# EAGLE design Airflow (EAGLE 7.2.0)
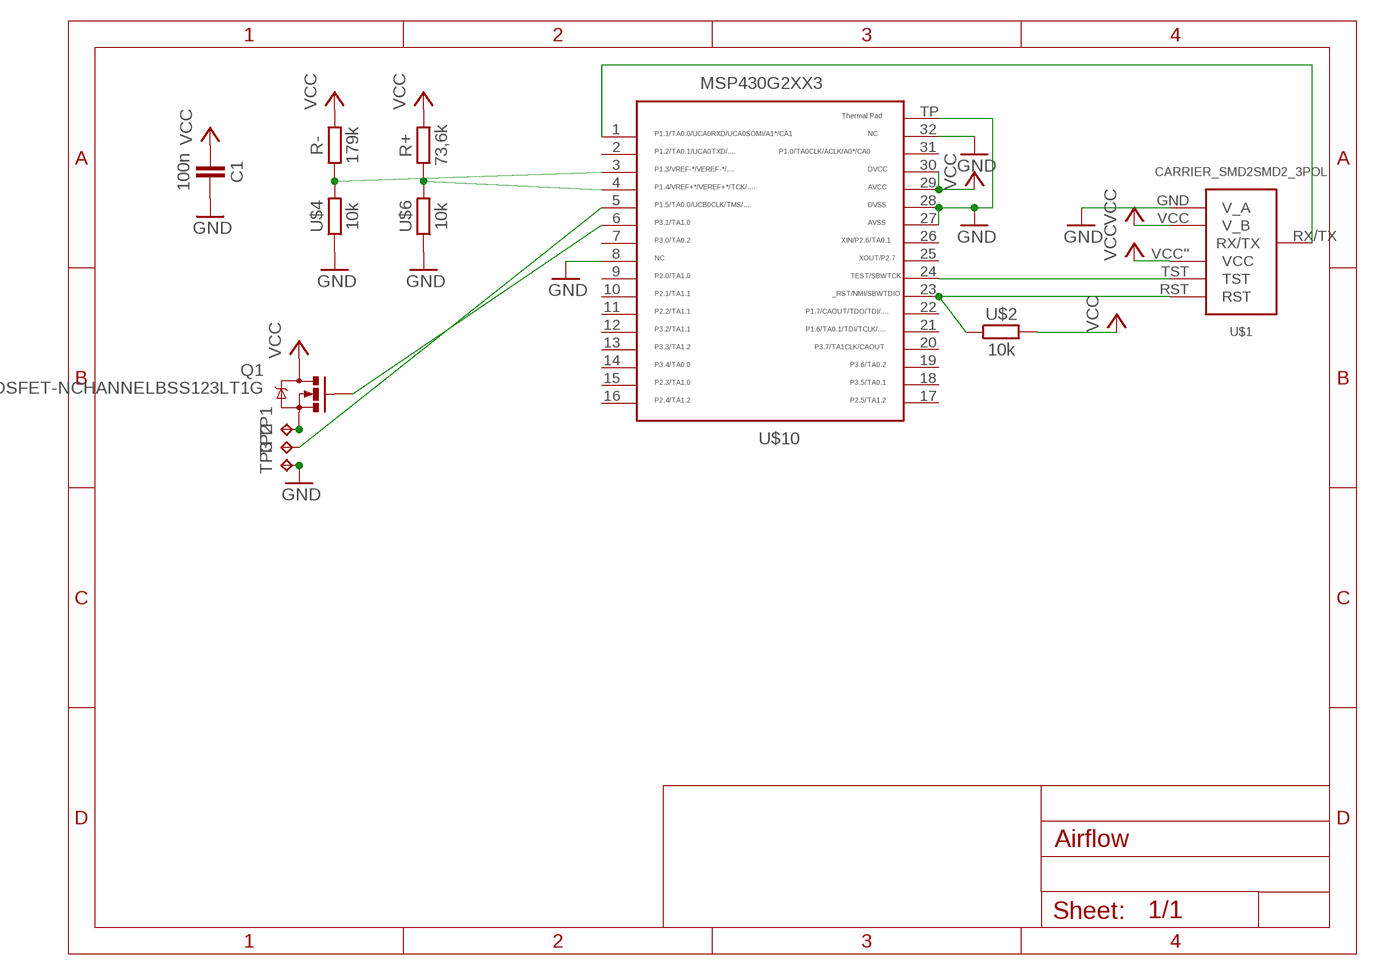
[diagram p0: schematic, sheet 1]

## Parts
C1  100n  CAPACITOR  [603]
Q1  MOSFET-NCHANNELBSS123LT1G  [SOT23-3]
R+  73,6k  RESISTOR0603  [603]
R-  179k  RESISTOR0603  [603]
TP1  TPTP18SQ  [TP18SQ]
TP2  TPTP18SQ  [TP18SQ]
TP3  TPTP18SQ  [TP18SQ]
U$1  CARRIER_SMD2SMD2_3POL  [CARRIER_SMD2_3POL]
U$2  10k  RESISTOR0603  [603]
U$4  10k  RESISTOR0603  [603]
U$6  10k  RESISTOR0603  [603]
U$10  MSP430G2553  [QFN32]

## Nets
GND: C1.2 TP3.TP U$1.GND(V_A) U$4.1 U$6.1 U$10.8 U$10.27 U$10.28 U$10.32 U$10.TP
N$2: R-.1 U$4.2 U$10.3
N$3: U$1.TST U$10.24
N$4: U$1.RST U$2.1 U$10.23
N$5: R+.1 U$6.2 U$10.4
N$6: TP2.TP U$10.5
N$7: Q1.2(S) TP1.TP
N$11: Q1.1(G) U$10.6
N$12: U$1.RX/TX U$10.1
VCC: C1.1 Q1.3(D) R+.2 R-.2 U$1.VCC''(VCC) U$1.VCC(V_B) U$2.2 U$10.29 U$10.30
Unconnected: U$10.2 U$10.7 U$10.9 U$10.10 U$10.11 U$10.12 U$10.13 U$10.14 U$10.15 U$10.16 U$10.17 U$10.18 U$10.19 U$10.20 U$10.21 U$10.22 U$10.25 U$10.26 U$10.31

## Library data of the parts
C1 = thar:CAPACITOR
Q1 = SparkFun-DiscreteSemi:MOSFET-NCHANNEL: Common NMOSFET Parts MFG P/N Store ID Prod ID FDD8780 TRANS-09984 SI7820DN TRANS-11055 FDS6630A IC-08089 2N7002PW TRANS-11151 FQP30N06L COM-10213 TRANS-10060 BSS123LT1G TRANS-08345 BSS138 TRANS-00830 BS170 2N7000; PROD_ID: TRANS-08345
R+ R- U$2 U$4 U$6 = thar:RESISTOR
TP1-TP3 = testpad:TP: Test pad
U$1 = thar:CARRIER_SMD2
U$10 = thar:MSP430G2553: TEXAS INSTRUMENTS MSP430G2553IRHB32R MCU, 16BIT, MSP430, 16MHZ, QFN-32 Farnell Best.Nr.: 2325726 Herst.Bez.: MSP430G2553IRHB32R

## Board
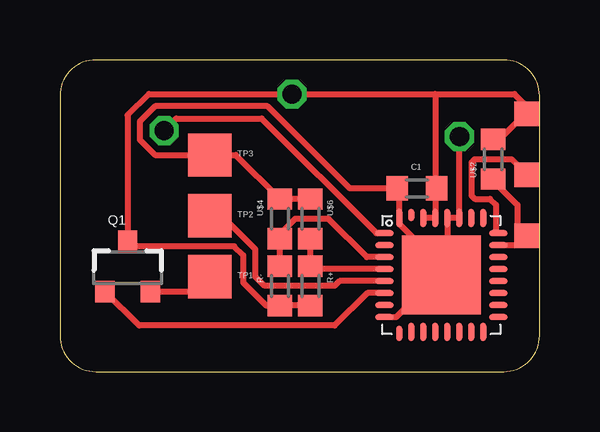
[diagram p1: board, top side]
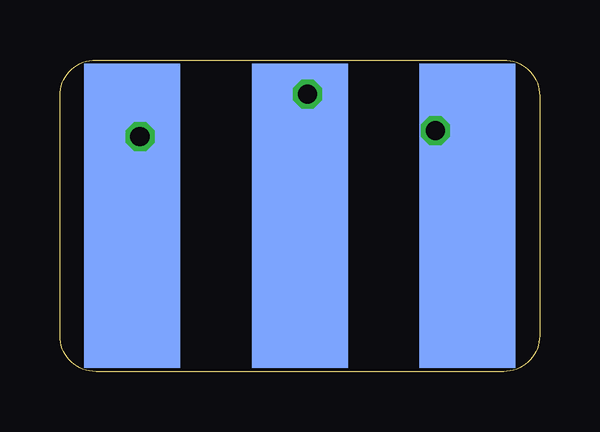
[diagram p2: board, bottom side, seen from below]

Size 20 x 13 mm. Coordinates in mm from the lower left corner, seen from the top.
Copper layers (1*16): Top 0.035mm / dielectric 1.5mm / Bottom 0.035mm
Design rules "Bilex DRU *": minimum track width 10mil, minimum drill 24mil, track to track 10mil, track to pad 10mil, pad to pad 10mil, via to via 10mil, smd to smd 10mil, copper to edge 1mil, drill to drill 8mil, minimum pad ring 10mil, minimum via ring 8mil, stop-mask expansion 4mil, vias tented up to drill 0mil, thermal gap 10mil

### Footprints (pad centres in the part's own frame; a part is rotated, then mirrored left to right if it is on the bottom)
603 = smd 0.889 x 1.016: 1 -0.826,0; 2 0.826,0
SOT23-3 = smd 0.8 x 0.9: 1 -0.95,-1; 2 0.95,-1; 3 0,1.1
TP18SQ = smd 1.8 x 1.8: TP 0,0
CARRIER_SMD2_3POL = smd 4 x 12.7 bottom: GND -6.985,0; RX/TX 6.985,0; VCC 0,0 | smd 1.016 x 1.016: RST -9.461,0.826; TST -9.461,-1.714; VCC'' -9.461,-4.255
QFN32 = smd 0.762 x 0.254: 1 -2.375,1.75; 2 -2.375,1.25; 3 -2.375,0.75; 4 -2.375,0.25; 5 -2.375,-0.25; 6 -2.375,-0.75; 7 -2.375,-1.25; 8 -2.375,-1.75; 17 2.375,-1.75; 18 2.375,-1.25; 19 2.375,-0.75; 20 2.375,-0.25; 21 2.375,0.25; 22 2.375,0.75; 23 2.375,1.25; 24 2.375,1.75 | smd 0.254 x 0.635: 9 -1.75,-2.438 | smd 0.254 x 0.762: 10 -1.25,-2.375; 11 -0.75,-2.375; 12 -0.25,-2.375; 13 0.25,-2.375; 14 0.75,-2.375; 15 1.25,-2.375; 16 1.75,-2.375; 25 1.75,2.375; 26 1.25,2.375; 27 0.75,2.375; 28 0.25,2.375; 29 -0.25,2.375; 30 -0.75,2.375; 32 -1.75,2.375 | smd 0.254 x 0.508: 31 -1.25,2.5 | smd 3.302 x 3.302: TP 0,0

### Placement (x,y rotation side)
C1  14.89,7.64 180 top
Q1  2.82,4.34 0 top
R+  10.44,3.58 270 top
R-  9.17,3.58 270 top
TP1  6.25,3.96 0 top
TP2  6.25,6.5 0 top
TP3  6.25,9.04 0 top
U$1  10,6.5 180 top
U$2  18.06,8.86 90 top
U$4  9.17,6.37 270 top
U$6  10.44,6.37 270 top
U$10  15.9,4.03 0 top

### Tracks (layer width: path | path; a pad name or v marks a point on that pad's centre or on a via)
GND  (via drill 0.8)
  Top 0.254: 16.43,4.35 16.19,5.38 16.16,5.35 | 16.43,4.35 16.48,3.06 U$10.TP 15.01,2.94 14.89,3.14 14.03,2.28 U$10.8 | 14.12,7.58 C1.2 | 16.15,4.72 U$10.28 U$10.27 16.65,9.79 v16.66,9.8 | 16.15,4.72 16.15,4.42 16.43,4.35 | 16.15,4.72 15.52,5.35 14.76,5.55 14.15,6.16 U$10.32 14.15,6.98 14.12,7.51 14.06,7.58 C1.2 | C1.2 14.06,7.7 | 14.06,7.7 14.12,7.77 14,7.77 14.06,7.7 | 14.06,7.7 14.12,7.64 12.09,7.64 8.66,11.07 3.96,11.07 3.33,10.43 3.33,9.67 3.96,9.04 TP3.TP 7.33,9.04 U$4.1 U$6.1
  Bottom 0.254: 18,6.5 17.81,6.69 v16.66,9.8 16.98,10.37 U$1.GND
N$2
  Top 0.254: R-.1 U$4.2 9.17,5.74 9.81,6.37 11.2,6.37 12.79,4.78 U$10.3
N$3
  Top 0.254: 19.61,7.88 19.46,8.02 19.5,8.18 U$1.TST | U$10.24 18.19,5.78 18.19,6.95 17.93,7.21 17.3,7.21 17.17,7.33 17.17,8.73 17.3,8.86 18.82,8.86 19.43,8.25 U$1.TST | U$1.TST
N$4
  Top 0.254: 19.46,5.48 19.5,5.38 | 19.46,5.48 19.5,5.69 | 19.5,5.69 19.08,5.74 19.08,6.95 18.06,7.97 U$2.1 | U$10.23 19.28,5.28 19.46,5.48 | 19.5,5.69 19.48,5.69 U$1.RST
N$5
  Top 0.254: U$6.2 R+.1 10.56,4.28 U$10.4
N$6
  Top 0.254: U$10.5 11.66,3.78 11.46,3.58 8.54,3.58 8.16,3.96 8.16,5.1 6.76,6.5 TP2.TP
N$7
  Top 0.254: Q1.2 5.63,3.34 TP1.TP
N$11
  Top 0.254: U$10.6 12.81,3.28 11.46,1.92 3.31,1.92 Q1.1
N$12  (via drill 0.8)
  Top 0.254: 13.32,5.78 U$10.1 13.19,5.78 8.41,10.56 4.85,10.56 v4.35,10.05
  Bottom 0.254: U$1.RX/TX 3.4,9.74 v4.35,10.05
VCC  (via drill 0.8)
  Top 0.254: U$10.29 | 15.65,11.58 15.65,8.02 | 15.65,8.02 U$10.29 | 15.65,7.77 15.59,8.02 | 15.59,8.02 15.65,8.02 | U$10.29 U$10.30 | C1.1 15.59,8.02 | 19.5,10.52 19.46,10.56 | U$2.2 18.12,9.48 19.2,10.56 19.2,10.51 19.46,10.56 | 19.46,10.56 19.65,10.75 19.65,10.95 19.58,10.95 18.95,11.58 15.65,11.58 | 19.46,10.56 U$1.VCC'' | 15.65,11.58 v9.68,11.58 3.71,11.58 2.82,10.69 Q1.3 2.82,5.23 7.27,5.23 7.65,4.85 7.65,3.7 8.6,2.75 R+.2 R-.2
  Bottom 0.254: U$1.VCC 10,12.15 v9.68,11.58